# Altium schematic sheet Xplained_Interface.SchDoc: Vacuum chamber sensorboard - Xplained interface
size A4; SheetNumber: 6; SheetTotal: 6; PageSetup: Record=PageOptions|CenterHorizontal=True|CenterVertical=True|PrintScale=0.97|XCorrection=1.00|YCorrection=1.00|PrintKind=0|BorderSize=5000000|LeftOffset=0|BottomOffset=0|Orientation=2|PaperLength=1000|PaperWidth=1000|Scale=100|PaperSource=7|PrintQuality=-4|MediaType=1|DitherType=10|PaperKind=A4|PrintScaleMode=1
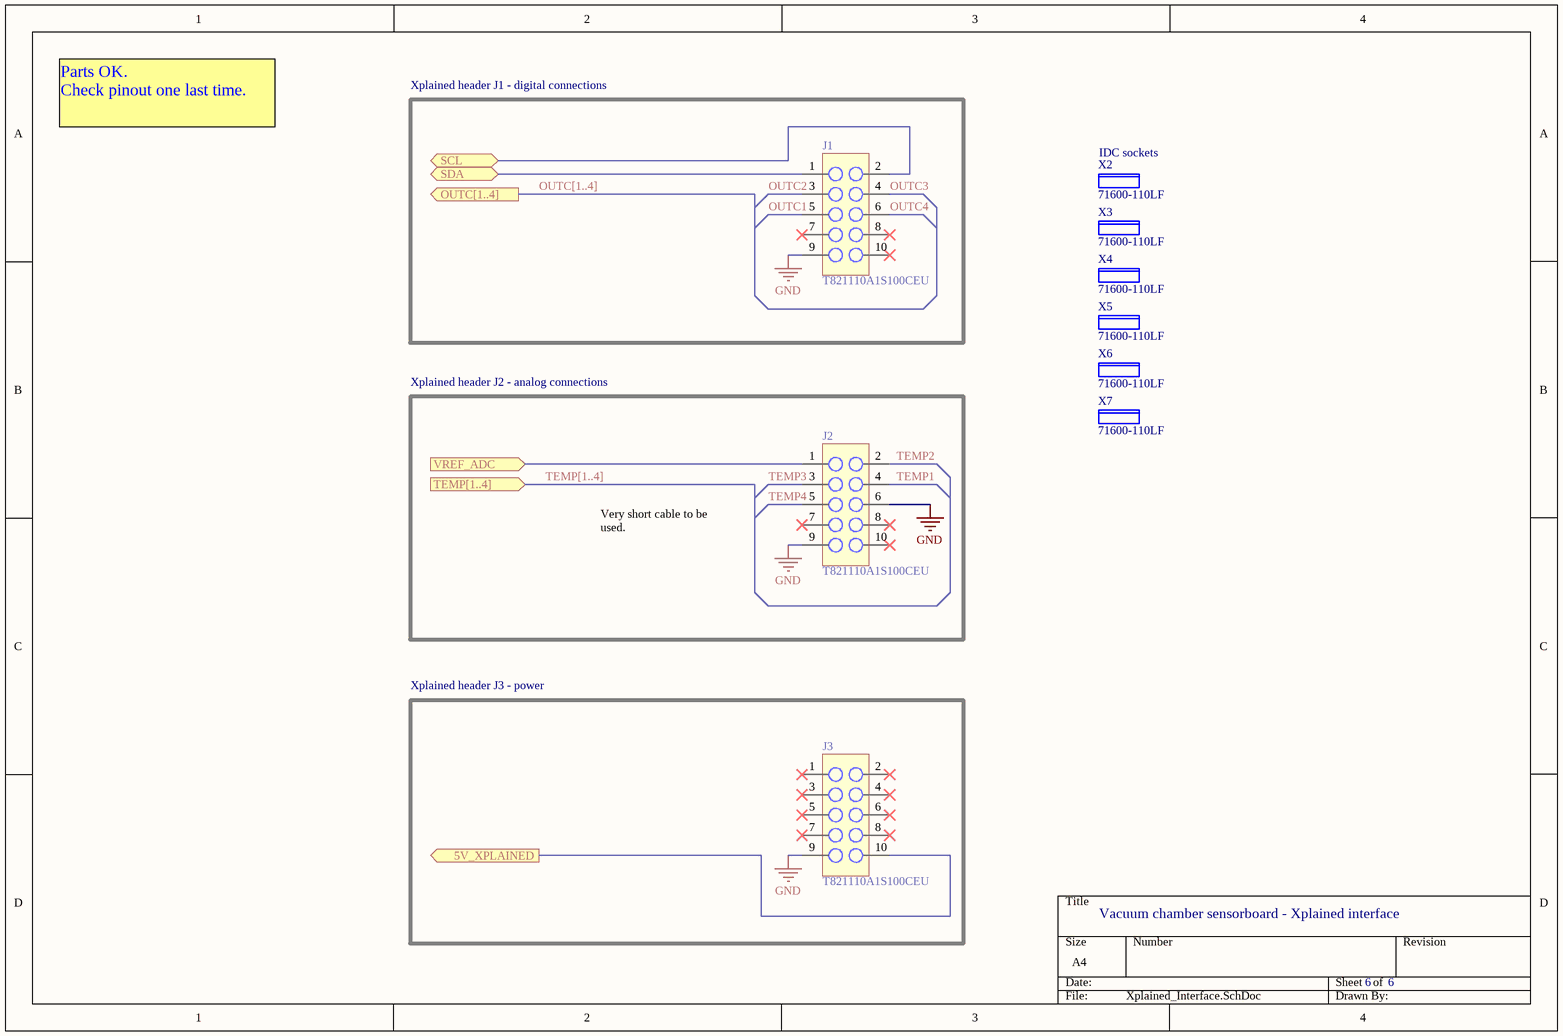
[diagram p0: Xplained_Interface.SchDoc]

## Parts
J1  T821110A1S100CEU  [Header 10P]
J2  T821110A1S100CEU  [Header 10P]
J3  T821110A1S100CEU  [Header 10P]
X2  71600-110LF  (mechanical)
X3  71600-110LF  (mechanical)
X4  71600-110LF  (mechanical)
X5  71600-110LF  (mechanical)
X6  71600-110LF  (mechanical)
X7  71600-110LF  (mechanical)

## Blocks framed on the sheet
Xplained header J1 - digital connections: J1
Xplained header J2 - analog connections: J2
Xplained header J3 - power: J3

## Ports
5V_XPLAINED (out), OUTC[1..4] (out), SCL (bidir), SDA (bidir), TEMP[1..4] (in), VREF_ADC (in)

## Nets
GND: J1.9 J2.6 J2.9 J3.9
5V_XPLAINED: J3.10 ; port 5V_XPLAINED
OUTC1: J1.5
OUTC2: J1.3
OUTC3: J1.4
OUTC4: J1.6
SCL: J1.2 ; port SCL
SDA: J1.1 ; port SDA
TEMP1: J2.4
TEMP2: J2.2
TEMP3: J2.3
TEMP4: J2.5
VREF_ADC: J2.1 ; port VREF_ADC

Not connected (* = marked no-connect by the designer): J1 7* 8* 10*; J2 7* 8* 10*; J3 1* 2* 3* 4* 5* 6* 7* 8*

## Buses and harness runs
bus OUTC[1..4] = port OUTC[1..4]
bus TEMP[1..4] = port TEMP[1..4]

## Notes on the sheet
- Parts OK.
  Check pinout one last time.
- (near X2) IDC sockets
- Very short cable to be used.

## Library data of the parts
J1-J3 = T821110A1S100CEU: Header, 2x5, 2.54mm; Manufacturer: Amphenol; ComponentLink1Description: Datasheet; ComponentLink1URL: http://www.farnell.com/datasheets/1648843.pdf; PackageReference: DIP-10; Supplier 1: Farnell; Supplier Part Number 1: 2215304
X2-X7 = 71600-110LF: IDC socket, 10way, 2.54 mm; Manufacturer: FCI; ComponentLink1Description: Datasheet; ComponentLink1URL: http://www.farnell.com/datasheets/3453.pdf; Supplier 1: Farnell; Supplier Part Number 1: 1103927